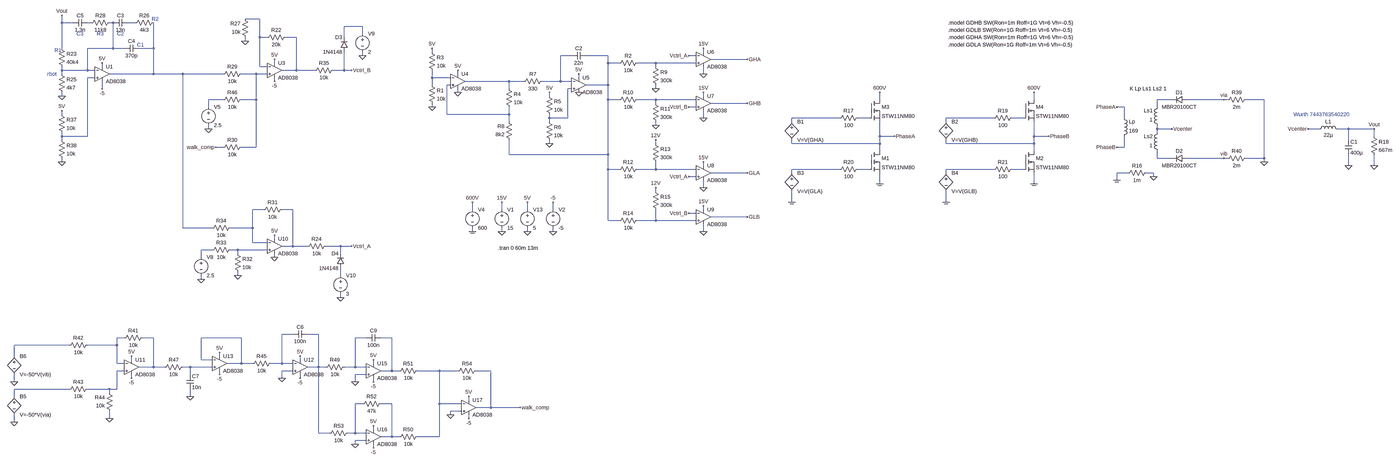
[diagram p0: schematic Full_Bridge_Converter.asc, whole sheet]
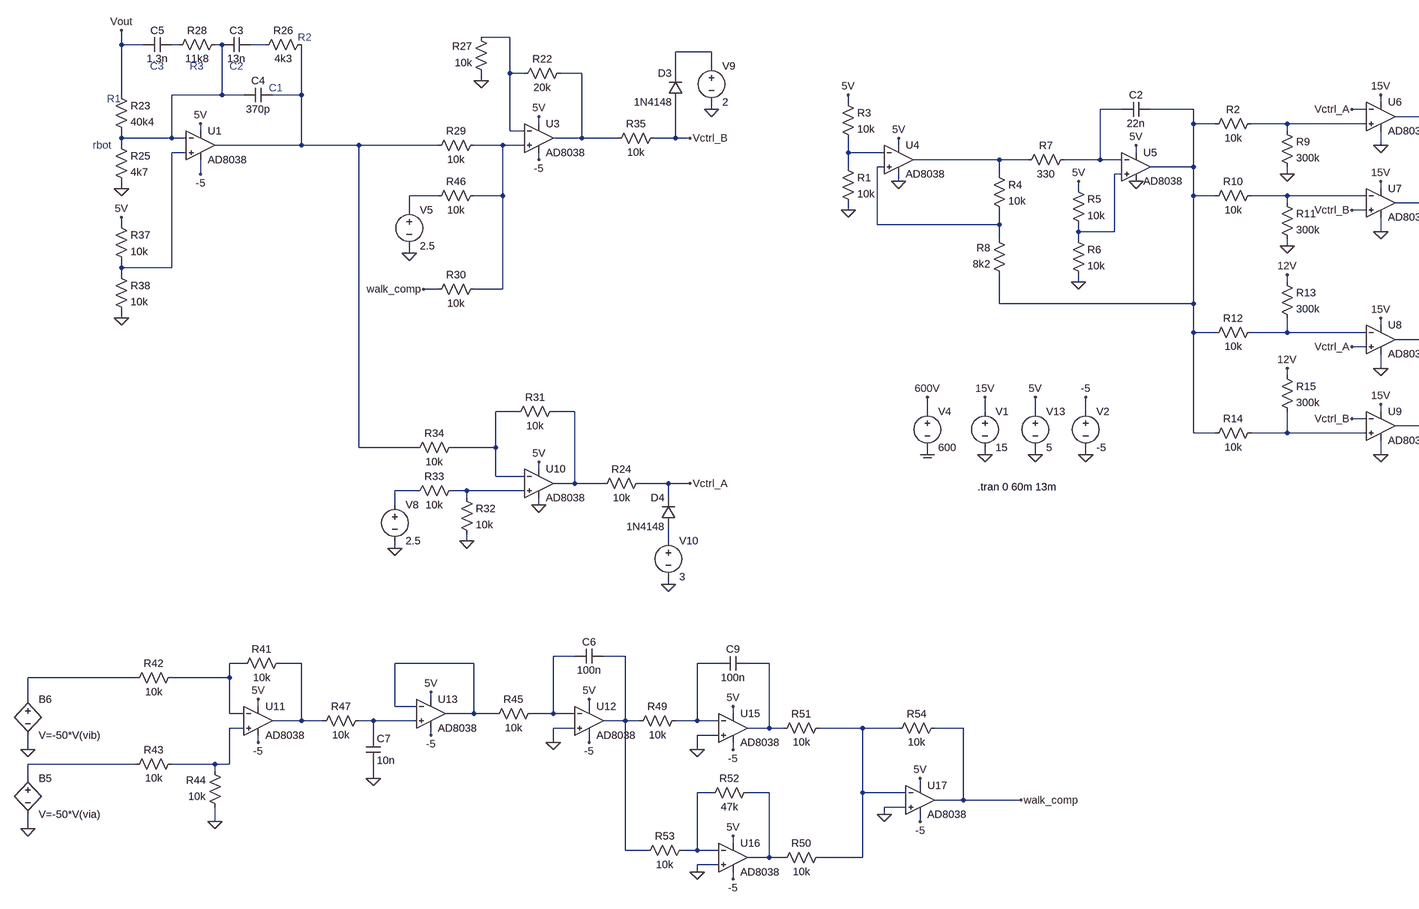
[diagram p1: schematic Full_Bridge_Converter.asc, part, row 1 of 1, column 1 of 2]
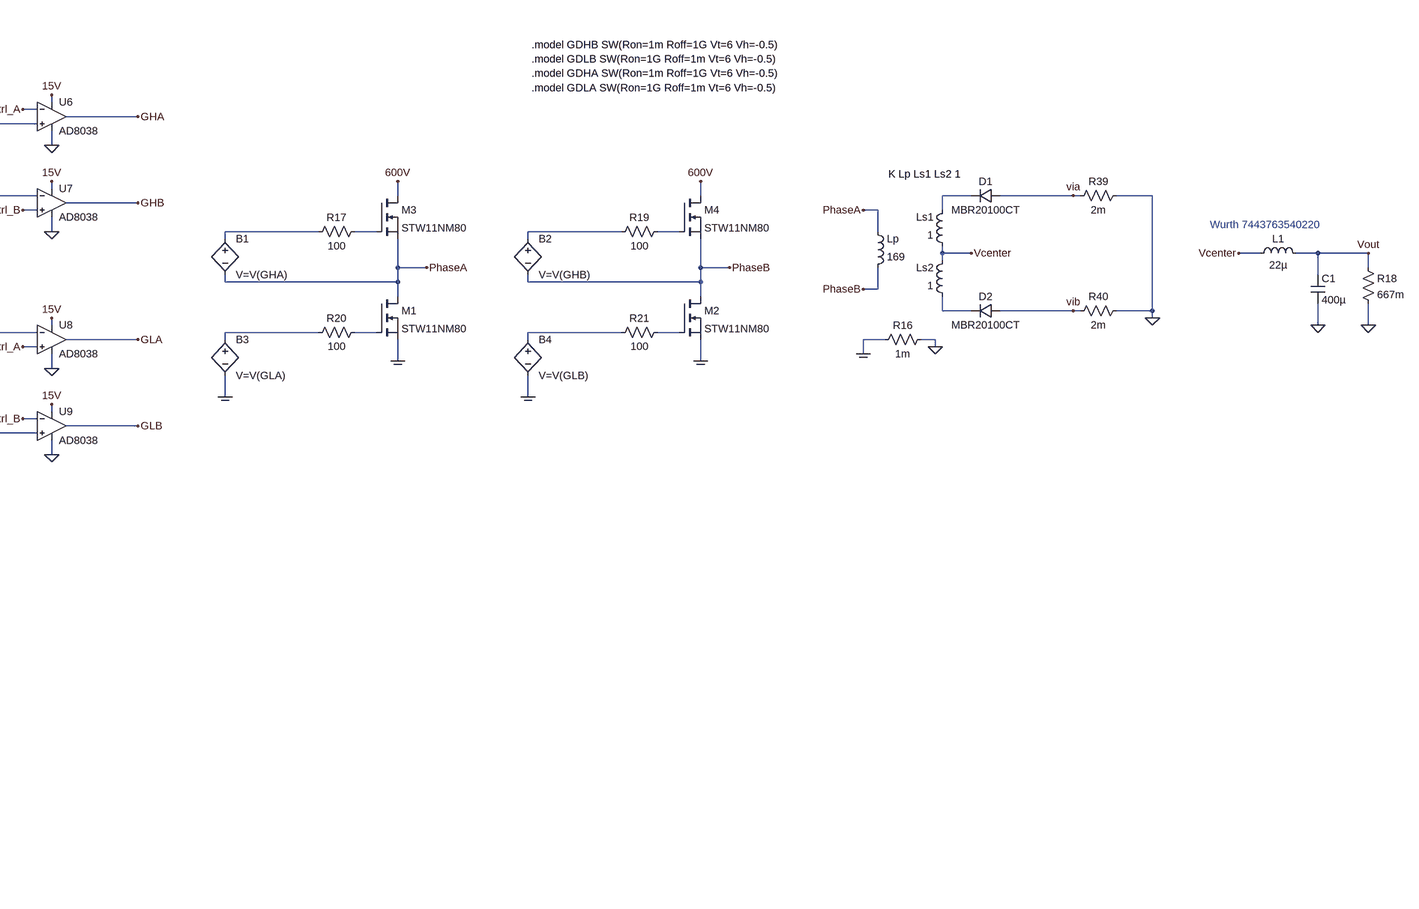
[diagram p2: schematic Full_Bridge_Converter.asc, part, row 1 of 1, column 2 of 2]
Full_Bridge_Converter.asc, the LTspice schematic file:
Version 4.1
SHEET 1 7284 1480
WIRE 320 -464 256 -464
WIRE -544 -448 -544 -480
WIRE -496 -448 -544 -448
WIRE -416 -448 -432 -448
WIRE -320 -448 -336 -448
WIRE -224 -448 -256 -448
WIRE 768 -432 688 -432
WIRE 768 -400 768 -432
WIRE 320 -384 320 -464
WIRE 352 -384 320 -384
WIRE 480 -384 432 -384
WIRE 688 -384 688 -432
WIRE 256 -368 256 -384
WIRE -544 -336 -544 -448
WIRE -320 -336 -320 -448
WIRE -320 -336 -432 -336
WIRE -272 -336 -320 -336
WIRE -144 -336 -144 -448
WIRE -144 -336 -208 -336
WIRE 1072 -320 1072 -336
WIRE 2256 -320 2256 -336
WIRE 768 -304 768 -320
WIRE 1680 -304 1632 -304
WIRE 1840 -304 1744 -304
WIRE 2224 -304 2192 -304
WIRE 2448 -288 2288 -288
WIRE 384 -272 384 -288
WIRE 1840 -272 1840 -304
WIRE 1888 -272 1840 -272
WIRE 2048 -272 1968 -272
WIRE 2224 -272 2048 -272
WIRE -368 -256 -368 -272
WIRE 320 -256 320 -384
WIRE 352 -256 320 -256
WIRE 2048 -256 2048 -272
WIRE -544 -240 -544 -256
WIRE -432 -240 -432 -336
WIRE -432 -240 -544 -240
WIRE -400 -240 -432 -240
WIRE 480 -240 480 -384
WIRE 480 -240 416 -240
WIRE 560 -240 480 -240
WIRE 688 -240 688 -320
WIRE 688 -240 640 -240
WIRE 720 -240 688 -240
WIRE -544 -224 -544 -240
WIRE -144 -224 -144 -336
WIRE -144 -224 -336 -224
WIRE -16 -224 -144 -224
WIRE 160 -224 -16 -224
WIRE 304 -224 240 -224
WIRE 352 -224 304 -224
WIRE 1184 -224 1184 -240
WIRE 2256 -224 2256 -256
WIRE -400 -208 -432 -208
WIRE 1072 -208 1072 -240
WIRE 1152 -208 1072 -208
WIRE 1712 -208 1712 -224
WIRE 384 -192 384 -208
WIRE 1408 -192 1216 -192
WIRE 1472 -192 1408 -192
WIRE 1632 -192 1632 -304
WIRE 1632 -192 1552 -192
WIRE 1680 -192 1632 -192
WIRE 1072 -176 1072 -208
WIRE 1152 -176 1136 -176
WIRE 1840 -176 1840 -272
WIRE 1840 -176 1744 -176
WIRE -368 -160 -368 -192
WIRE 1408 -160 1408 -192
WIRE 1680 -160 1664 -160
WIRE 2048 -160 2048 -176
WIRE 1184 -144 1184 -160
WIRE -544 -128 -544 -144
WIRE 1584 -128 1584 -144
WIRE 2256 -128 2256 -144
WIRE 160 -112 96 -112
WIRE 304 -112 304 -224
WIRE 304 -112 240 -112
WIRE 1840 -112 1840 -176
WIRE 1888 -112 1840 -112
WIRE 2048 -112 1968 -112
WIRE 2224 -112 2048 -112
WIRE 3184 -112 3184 -144
WIRE 3984 -112 3984 -144
WIRE 4704 -112 4640 -112
WIRE 4944 -112 4768 -112
WIRE 4960 -112 4944 -112
WIRE 5120 -112 5040 -112
WIRE 2048 -96 2048 -112
WIRE 2448 -96 2288 -96
WIRE 96 -80 96 -112
WIRE 1072 -80 1072 -96
WIRE 2224 -80 2192 -80
WIRE 4496 -80 4464 -80
WIRE 4640 -80 4640 -112
WIRE -544 -48 -544 -64
WIRE 1136 -48 1136 -176
WIRE 1408 -48 1408 -80
WIRE 1408 -48 1136 -48
WIRE 1584 -32 1584 -48
WIRE 1664 -32 1664 -160
WIRE 1664 -32 1584 -32
WIRE 2256 -32 2256 -64
WIRE 3008 -32 2800 -32
WIRE 3136 -32 3088 -32
WIRE 3808 -32 3600 -32
WIRE 3936 -32 3888 -32
WIRE 4496 -32 4496 -80
WIRE 1408 -16 1408 -48
WIRE 1584 -16 1584 -32
WIRE 2800 -16 2800 -32
WIRE 3600 -16 3600 -32
WIRE 2048 0 2048 -16
WIRE 96 16 96 0
WIRE 4640 16 4640 0
WIRE 4704 16 4640 16
WIRE 5360 16 5312 16
WIRE 5488 16 5440 16
WIRE 5600 16 5488 16
WIRE 4640 32 4640 16
WIRE -544 48 -544 32
WIRE -432 48 -432 -208
WIRE -432 48 -544 48
WIRE 3184 48 3184 -16
WIRE 3248 48 3184 48
WIRE 3984 48 3984 -16
WIRE 4048 48 3984 48
WIRE 5600 48 5600 16
WIRE -544 64 -544 48
WIRE 5488 64 5488 16
WIRE 1584 80 1584 64
WIRE 2048 80 2048 64
WIRE 2800 80 2800 64
WIRE 3184 80 3184 48
WIRE 3184 80 2800 80
WIRE 3600 80 3600 64
WIRE 3984 80 3984 48
WIRE 3984 80 3600 80
WIRE 160 96 128 96
WIRE 304 96 304 -112
WIRE 304 96 240 96
WIRE 4496 96 4496 48
WIRE 4496 96 4464 96
WIRE 3184 112 3184 80
WIRE 3984 112 3984 80
WIRE 1408 128 1408 64
WIRE 1840 128 1840 -112
WIRE 1840 128 1408 128
WIRE 4640 144 4640 112
WIRE 4704 144 4640 144
WIRE 4944 144 4768 144
WIRE 4960 144 4944 144
WIRE 5120 144 5120 -112
WIRE 5120 144 5040 144
WIRE -544 160 -544 144
WIRE 5120 160 5120 144
WIRE 2256 176 2256 160
WIRE 5488 176 5488 128
WIRE 5600 176 5600 128
WIRE 1840 192 1840 128
WIRE 1888 192 1840 192
WIRE 2048 192 2048 160
WIRE 2048 192 1968 192
WIRE 2224 192 2048 192
WIRE 3008 192 2800 192
WIRE 3136 192 3088 192
WIRE 3808 192 3600 192
WIRE 3936 192 3888 192
WIRE 2448 208 2288 208
WIRE 2800 208 2800 192
WIRE 3600 208 3600 192
WIRE 4512 208 4464 208
WIRE 4624 208 4592 208
WIRE 2224 224 2192 224
WIRE 4624 224 4624 208
WIRE 4464 240 4464 208
WIRE 3184 256 3184 208
WIRE 3984 256 3984 208
WIRE 2256 272 2256 240
WIRE 2048 288 2048 272
WIRE 2800 336 2800 288
WIRE 3600 336 3600 288
WIRE 336 368 288 368
WIRE 464 368 416 368
WIRE 1248 368 1248 336
WIRE 1376 368 1376 336
WIRE 1488 368 1488 336
WIRE 1600 368 1600 336
WIRE 2256 368 2256 352
WIRE 2224 384 2192 384
WIRE 2448 400 2288 400
WIRE 1840 416 1840 192
WIRE 1888 416 1840 416
WIRE 2048 416 2048 368
WIRE 2048 416 1968 416
WIRE 2224 416 2048 416
WIRE -16 448 -16 -224
WIRE 112 448 -16 448
WIRE 288 448 288 368
WIRE 288 448 192 448
WIRE 1248 464 1248 448
WIRE 1376 464 1376 448
WIRE 1488 464 1488 448
WIRE 1600 464 1600 448
WIRE 2256 464 2256 432
WIRE 384 496 384 480
WIRE 288 512 288 448
WIRE 352 512 288 512
WIRE 464 528 464 368
WIRE 464 528 416 528
WIRE 528 528 464 528
WIRE 672 528 608 528
WIRE 720 528 672 528
WIRE 112 544 64 544
WIRE 224 544 192 544
WIRE 352 544 224 544
WIRE 224 560 224 544
WIRE 672 560 672 528
WIRE 64 576 64 544
WIRE 384 576 384 560
WIRE 224 656 224 640
WIRE 672 656 672 624
WIRE 64 672 64 656
WIRE 672 752 672 736
WIRE 464 912 416 912
WIRE 576 912 528 912
WIRE -272 928 -304 928
WIRE -144 928 -192 928
WIRE 240 928 64 928
WIRE 784 928 736 928
WIRE 896 928 848 928
WIRE -512 960 -752 960
WIRE -304 960 -304 928
WIRE -304 960 -432 960
WIRE -752 1008 -752 960
WIRE 144 1008 144 992
WIRE -240 1024 -240 1008
WIRE 64 1024 64 928
WIRE 112 1024 64 1024
WIRE 496 1024 496 1008
WIRE -304 1040 -304 960
WIRE -272 1040 -304 1040
WIRE 240 1040 240 928
WIRE 240 1040 176 1040
WIRE 288 1040 240 1040
WIRE 416 1040 416 912
WIRE 416 1040 368 1040
WIRE 464 1040 416 1040
WIRE 816 1040 816 1024
WIRE -144 1056 -144 928
WIRE -144 1056 -208 1056
WIRE -96 1056 -144 1056
WIRE 16 1056 -16 1056
WIRE 112 1056 16 1056
WIRE 576 1056 576 912
WIRE 576 1056 528 1056
WIRE 608 1056 576 1056
WIRE 736 1056 736 928
WIRE 736 1056 688 1056
WIRE 784 1056 736 1056
WIRE -272 1072 -304 1072
WIRE 464 1072 416 1072
WIRE 896 1072 896 928
WIRE 896 1072 848 1072
WIRE 928 1072 896 1072
WIRE 1104 1072 1008 1072
WIRE 1184 1072 1104 1072
WIRE 1328 1072 1264 1072
WIRE 16 1088 16 1056
WIRE 144 1088 144 1072
WIRE 784 1088 736 1088
WIRE -240 1104 -240 1088
WIRE 416 1104 416 1072
WIRE 496 1104 496 1088
WIRE -752 1120 -752 1088
WIRE 736 1120 736 1088
WIRE 816 1120 816 1104
WIRE -512 1152 -752 1152
WIRE -336 1152 -432 1152
WIRE -304 1152 -304 1072
WIRE -304 1152 -336 1152
WIRE -336 1168 -336 1152
WIRE -752 1184 -752 1152
WIRE 16 1184 16 1152
WIRE 1232 1200 1232 1184
WIRE 768 1216 736 1216
WIRE 896 1216 848 1216
WIRE 1104 1216 1104 1072
WIRE 1200 1216 1104 1216
WIRE 1328 1232 1328 1072
WIRE 1328 1232 1264 1232
WIRE 1456 1232 1328 1232
WIRE 1200 1248 1152 1248
WIRE 1152 1264 1152 1248
WIRE -336 1280 -336 1248
WIRE 1232 1280 1232 1264
WIRE -752 1296 -752 1264
WIRE 816 1328 816 1312
WIRE 576 1344 576 1056
WIRE 624 1344 576 1344
WIRE 736 1344 736 1216
WIRE 736 1344 704 1344
WIRE 784 1344 736 1344
WIRE 896 1360 896 1216
WIRE 896 1360 848 1360
WIRE 928 1360 896 1360
WIRE 1104 1360 1104 1216
WIRE 1104 1360 1008 1360
WIRE 784 1376 736 1376
WIRE 736 1392 736 1376
WIRE 816 1408 816 1392
FLAG 1376 464 0
FLAG 1376 336 15V
FLAG 1184 -144 0
FLAG 1072 -80 0
FLAG 1584 80 0
FLAG 1712 -144 0
FLAG 2256 -224 0
FLAG 2256 -32 0
FLAG 2192 -304 Vctrl_A
FLAG 2192 -80 Vctrl_B
FLAG 2448 -288 GHA
FLAG 2448 -96 GHB
FLAG 2256 272 0
FLAG 2256 464 0
FLAG 2192 224 Vctrl_A
FLAG 2192 384 Vctrl_B
FLAG 2448 208 GLA
FLAG 2448 400 GLB
FLAG 2048 -160 0
FLAG 2048 0 0
FLAG 2048 64 12V
FLAG 2048 272 12V
FLAG 1248 336 600V
FLAG 3184 -144 600V
FLAG 3984 -144 600V
FLAG 4048 48 PhaseB
FLAG 3248 48 PhaseA
FLAG 4464 96 PhaseB
FLAG 4464 -80 PhaseA
FLAG -544 -128 0
FLAG 5600 16 Vout
FLAG -544 -480 Vout
FLAG 4624 224 0
FLAG 5488 176 0
FLAG 5600 176 0
FLAG 4464 240 COM
FLAG 3984 256 COM
FLAG 3600 336 COM
FLAG 3184 256 COM
FLAG 2800 336 COM
FLAG 1248 464 COM
FLAG 256 -368 0
FLAG 96 16 0
FLAG 384 576 0
FLAG 224 656 0
FLAG 64 672 0
FLAG 720 -240 Vctrl_B
FLAG 720 528 Vctrl_A
FLAG 672 752 0
FLAG 768 -304 0
FLAG 1488 464 0
FLAG 1488 336 5V
FLAG 1072 -336 5V
FLAG 1184 -240 5V
FLAG 1584 -144 5V
FLAG 1712 -224 5V
FLAG 1600 464 0
FLAG 1600 336 -5
FLAG -368 -160 -5
FLAG -368 -272 5V
FLAG -544 160 0
FLAG -544 -64 5V
FLAG 384 -288 5V
FLAG 384 480 5V
FLAG 2256 -336 15V
FLAG 2256 -144 15V
FLAG 2256 160 15V
FLAG 2256 352 15V
FLAG 5120 160 0
FLAG 5312 16 Vcenter
FLAG 4704 16 Vcenter
FLAG -752 1296 0
FLAG -752 1120 0
FLAG 4944 -112 via
FLAG 4944 144 vib
FLAG -240 1008 5V
FLAG -240 1104 -5
FLAG -336 1280 0
FLAG 128 96 walk_comp
FLAG 384 -192 -5
FLAG 496 1008 5V
FLAG 496 1104 -5
FLAG 416 1104 0
FLAG 16 1184 0
FLAG 144 992 5V
FLAG 144 1088 -5
FLAG 816 1024 5V
FLAG 816 1120 -5
FLAG 736 1120 0
FLAG 1456 1232 walk_comp
FLAG 816 1312 5V
FLAG 816 1408 -5
FLAG 1232 1184 5V
FLAG 1232 1280 -5
FLAG 1152 1264 0
FLAG 736 1392 0
SYMBOL voltage 1376 352 R0
WINDOW 123 0 0 Left 0
WINDOW 39 0 0 Left 0
SYMATTR InstName V1
SYMATTR Value 15
SYMBOL res 1056 -192 R0
SYMATTR InstName R1
SYMATTR Value 10k
SYMBOL res 1056 -336 R0
SYMATTR InstName R3
SYMATTR Value 10k
SYMBOL res 1392 -176 R0
SYMATTR InstName R4
SYMATTR Value 10k
SYMBOL OpAmps\\AD8038 1184 -256 R0
SYMATTR InstName U4
SYMBOL OpAmps\\AD8038 1712 -240 R0
SYMATTR InstName U5
SYMBOL res 1568 -144 R0
SYMATTR InstName R5
SYMATTR Value 10k
SYMBOL res 1568 -32 R0
SYMATTR InstName R6
SYMATTR Value 10k
SYMBOL res 1568 -208 R90
WINDOW 0 0 56 VBottom 2
WINDOW 3 32 56 VTop 2
SYMATTR InstName R7
SYMATTR Value 330
SYMBOL res 1424 80 R180
WINDOW 0 36 76 Left 2
WINDOW 3 36 40 Left 2
SYMATTR InstName R8
SYMATTR Value 8k2
SYMBOL cap 1744 -320 R90
WINDOW 0 0 32 VBottom 2
WINDOW 3 32 32 VTop 2
SYMATTR InstName C2
SYMATTR Value 22n
SYMBOL OpAmps\\AD8038 2256 -352 R0
SYMATTR InstName U6
SYMBOL OpAmps\\AD8038 2256 -160 R0
SYMATTR InstName U7
SYMBOL OpAmps\\AD8038 2256 144 R0
SYMATTR InstName U8
SYMBOL OpAmps\\AD8038 2256 336 R0
SYMATTR InstName U9
SYMBOL res 1984 -288 R90
WINDOW 0 0 56 VBottom 2
WINDOW 3 32 56 VTop 2
SYMATTR InstName R2
SYMATTR Value 10k
SYMBOL res 2032 -272 R0
SYMATTR InstName R9
SYMATTR Value 300k
SYMBOL res 1984 -128 R90
WINDOW 0 0 56 VBottom 2
WINDOW 3 32 56 VTop 2
SYMATTR InstName R10
SYMATTR Value 10k
SYMBOL res 2032 -112 R0
SYMATTR InstName R11
SYMATTR Value 300k
SYMBOL res 1984 176 R90
WINDOW 0 0 56 VBottom 2
WINDOW 3 32 56 VTop 2
SYMATTR InstName R12
SYMATTR Value 10k
SYMBOL res 1984 400 R90
WINDOW 0 0 56 VBottom 2
WINDOW 3 32 56 VTop 2
SYMATTR InstName R14
SYMATTR Value 10k
SYMBOL res 2032 64 R0
SYMATTR InstName R13
SYMATTR Value 300k
SYMBOL res 2032 272 R0
SYMATTR InstName R15
SYMATTR Value 300k
SYMBOL nmos 3136 112 R0
SYMATTR InstName M1
SYMATTR Value STW11NM80
SYMBOL voltage 1248 352 R0
WINDOW 123 0 0 Left 0
WINDOW 39 0 0 Left 0
SYMATTR InstName V4
SYMATTR Value 600
SYMBOL res 3104 -48 R90
WINDOW 0 0 56 VBottom 2
WINDOW 3 32 56 VTop 2
SYMATTR InstName R17
SYMATTR Value 100
SYMBOL res 3904 -48 R90
WINDOW 0 0 56 VBottom 2
WINDOW 3 32 56 VTop 2
SYMATTR InstName R19
SYMATTR Value 100
SYMBOL nmos 3936 112 R0
SYMATTR InstName M2
SYMATTR Value STW11NM80
SYMBOL nmos 3136 -112 R0
SYMATTR InstName M3
SYMATTR Value STW11NM80
SYMBOL nmos 3936 -112 R0
SYMATTR InstName M4
SYMATTR Value STW11NM80
SYMBOL bv 2800 -32 R0
SYMATTR InstName B1
SYMATTR Value V=V(GHA)
SYMBOL bv 3600 -32 R0
SYMATTR InstName B2
SYMATTR Value V=V(GHB)
SYMBOL ind 4480 64 M180
WINDOW 0 36 80 Left 2
WINDOW 3 36 40 Left 2
SYMATTR InstName Lp
SYMATTR Value 169
SYMATTR SpiceLine Rser=10m
SYMBOL ind 4656 16 R180
WINDOW 0 36 80 Left 2
WINDOW 3 36 40 Left 2
SYMATTR InstName Ls1
SYMATTR Value 1
SYMATTR SpiceLine Rser=10m
SYMBOL ind 4656 128 R180
WINDOW 0 36 80 Left 2
WINDOW 3 36 40 Left 2
SYMATTR InstName Ls2
SYMATTR Value 1
SYMATTR SpiceLine Rser=10m
SYMBOL res 4608 192 R90
WINDOW 0 0 56 VBottom 2
WINDOW 3 32 56 VTop 2
SYMATTR InstName R16
SYMATTR Value 1m
SYMBOL bv 2800 192 R0
SYMATTR InstName B3
SYMATTR Value V=V(GLA)
SYMBOL bv 3600 192 R0
SYMATTR InstName B4
SYMATTR Value V=V(GLB)
SYMBOL ind 5344 32 R270
WINDOW 0 32 56 VTop 2
WINDOW 3 5 56 VBottom 2
SYMATTR InstName L1
SYMATTR Value 22µ
SYMBOL cap 5472 64 R0
SYMATTR InstName C1
SYMATTR Value 400µ
SYMBOL res 5584 32 R0
SYMATTR InstName R18
SYMATTR Value 667m
SYMBOL diode 4768 -96 M270
WINDOW 0 32 32 VTop 2
WINDOW 3 0 32 VBottom 2
SYMATTR InstName D1
SYMATTR Value MBR20100CT
SYMBOL diode 4768 160 M270
WINDOW 0 32 32 VTop 2
WINDOW 3 0 32 VBottom 2
SYMATTR InstName D2
SYMATTR Value MBR20100CT
SYMBOL res 3104 176 R90
WINDOW 0 0 56 VBottom 2
WINDOW 3 32 56 VTop 2
SYMATTR InstName R20
SYMATTR Value 100
SYMBOL res 3904 176 R90
WINDOW 0 0 56 VBottom 2
WINDOW 3 32 56 VTop 2
SYMATTR InstName R21
SYMATTR Value 100
SYMBOL res -560 -352 R0
SYMATTR InstName R23
SYMATTR Value 40k4
SYMBOL res -560 -240 R0
SYMATTR InstName R25
SYMATTR Value 4k7
SYMBOL cap -256 -464 R90
WINDOW 0 0 32 VBottom 2
WINDOW 3 32 32 VTop 2
SYMATTR InstName C3
SYMATTR Value 13n
SYMBOL cap -208 -352 R90
WINDOW 0 0 32 VBottom 2
WINDOW 3 32 32 VTop 2
SYMATTR InstName C4
SYMATTR Value 370p
SYMBOL res -128 -464 R90
WINDOW 0 0 56 VBottom 2
WINDOW 3 32 56 VTop 2
SYMATTR InstName R26
SYMATTR Value 4k3
SYMBOL OpAmps\\AD8038 -368 -288 R0
SYMATTR InstName U1
SYMBOL OpAmps\\AD8038 384 -304 R0
SYMATTR InstName U3
SYMBOL res 448 -400 R90
WINDOW 0 0 56 VBottom 2
WINDOW 3 32 56 VTop 2
SYMATTR InstName R22
SYMATTR Value 20k
SYMBOL res 272 -368 R180
WINDOW 0 36 76 Left 2
WINDOW 3 36 40 Left 2
SYMATTR InstName R27
SYMATTR Value 10k
SYMBOL res 256 -240 R90
WINDOW 0 0 56 VBottom 2
WINDOW 3 32 56 VTop 2
SYMATTR InstName R29
SYMATTR Value 10k
SYMBOL res 256 80 R90
WINDOW 0 0 56 VBottom 2
WINDOW 3 32 56 VTop 2
SYMATTR InstName R30
SYMATTR Value 10k
SYMBOL voltage 96 -96 R0
WINDOW 123 0 0 Left 0
WINDOW 39 0 0 Left 0
SYMATTR InstName V5
SYMATTR Value 2.5
SYMBOL OpAmps\\AD8038 384 464 R0
SYMATTR InstName U10
SYMBOL res 432 352 R90
WINDOW 0 0 56 VBottom 2
WINDOW 3 32 56 VTop 2
SYMATTR InstName R31
SYMATTR Value 10k
SYMBOL res 208 544 R0
SYMATTR InstName R32
SYMATTR Value 10k
SYMBOL res 208 528 R90
WINDOW 0 0 56 VBottom 2
WINDOW 3 32 56 VTop 2
SYMATTR InstName R33
SYMATTR Value 10k
SYMBOL res 208 432 R90
WINDOW 0 0 56 VBottom 2
WINDOW 3 32 56 VTop 2
SYMATTR InstName R34
SYMATTR Value 10k
SYMBOL voltage 64 560 R0
WINDOW 123 0 0 Left 0
WINDOW 39 0 0 Left 0
SYMATTR InstName V8
SYMATTR Value 2.5
SYMBOL diode 688 624 R180
WINDOW 0 24 64 Left 2
WINDOW 3 24 0 Left 2
SYMATTR InstName D4
SYMATTR Value 1N4148
SYMBOL voltage 672 640 R0
WINDOW 123 0 0 Left 0
WINDOW 39 0 0 Left 0
SYMATTR InstName V10
SYMATTR Value 3
SYMBOL res 624 512 R90
WINDOW 0 0 56 VBottom 2
WINDOW 3 32 56 VTop 2
SYMATTR InstName R24
SYMATTR Value 10k
SYMBOL res 656 -256 R90
WINDOW 0 0 56 VBottom 2
WINDOW 3 32 56 VTop 2
SYMATTR InstName R35
SYMATTR Value 10k
SYMBOL diode 704 -320 R180
WINDOW 0 24 64 Left 2
WINDOW 3 24 0 Left 2
SYMATTR InstName D3
SYMATTR Value 1N4148
SYMBOL voltage 768 -416 R0
WINDOW 123 0 0 Left 0
WINDOW 39 0 0 Left 0
SYMATTR InstName V9
SYMATTR Value 2
SYMBOL res -320 -464 R90
WINDOW 0 0 56 VBottom 2
WINDOW 3 32 56 VTop 2
SYMATTR InstName R28
SYMATTR Value 11k8
SYMBOL cap -432 -464 R90
WINDOW 0 0 32 VBottom 2
WINDOW 3 32 32 VTop 2
SYMATTR InstName C5
SYMATTR Value 1.3n
SYMBOL voltage 1488 352 R0
WINDOW 123 0 0 Left 0
WINDOW 39 0 0 Left 0
SYMATTR InstName V13
SYMATTR Value 5
SYMBOL voltage 1600 352 R0
WINDOW 123 0 0 Left 0
WINDOW 39 0 0 Left 0
SYMATTR InstName V2
SYMATTR Value -5
SYMBOL res -560 -64 R0
SYMATTR InstName R37
SYMATTR Value 10k
SYMBOL res -560 48 R0
SYMATTR InstName R38
SYMATTR Value 10k
SYMBOL res 5056 -128 R90
WINDOW 0 0 56 VBottom 2
WINDOW 3 32 56 VTop 2
SYMATTR InstName R39
SYMATTR Value 2m
SYMBOL res 5056 128 R90
WINDOW 0 0 56 VBottom 2
WINDOW 3 32 56 VTop 2
SYMATTR InstName R40
SYMATTR Value 2m
SYMBOL bv -752 1168 R0
SYMATTR InstName B5
SYMATTR Value V=-50*V(via)
SYMBOL bv -752 992 R0
SYMATTR InstName B6
SYMATTR Value V=-50*V(vib)
SYMBOL OpAmps\\AD8038 -240 992 R0
SYMATTR InstName U11
SYMBOL res -176 912 R90
WINDOW 0 0 56 VBottom 2
WINDOW 3 32 56 VTop 2
SYMATTR InstName R41
SYMATTR Value 10k
SYMBOL res -416 944 R90
WINDOW 0 0 56 VBottom 2
WINDOW 3 32 56 VTop 2
SYMATTR InstName R42
SYMATTR Value 10k
SYMBOL res -416 1136 R90
WINDOW 0 0 56 VBottom 2
WINDOW 3 32 56 VTop 2
SYMATTR InstName R43
SYMATTR Value 10k
SYMBOL res -320 1264 R180
WINDOW 0 36 76 Left 2
WINDOW 3 36 40 Left 2
SYMATTR InstName R44
SYMATTR Value 10k
SYMBOL res 256 -128 R90
WINDOW 0 0 56 VBottom 2
WINDOW 3 32 56 VTop 2
SYMATTR InstName R46
SYMATTR Value 10k
SYMBOL OpAmps\\AD8038 496 992 R0
SYMATTR InstName U12
SYMBOL cap 528 896 R90
WINDOW 0 0 32 VBottom 2
WINDOW 3 32 32 VTop 2
SYMATTR InstName C6
SYMATTR Value 100n
SYMBOL res 384 1024 R90
WINDOW 0 0 56 VBottom 2
WINDOW 3 32 56 VTop 2
SYMATTR InstName R45
SYMATTR Value 10k
SYMBOL res 0 1040 R90
WINDOW 0 0 56 VBottom 2
WINDOW 3 32 56 VTop 2
SYMATTR InstName R47
SYMATTR Value 10k
SYMBOL cap 0 1088 R0
SYMATTR InstName C7
SYMATTR Value 10n
SYMBOL OpAmps\\AD8038 144 976 R0
SYMATTR InstName U13
SYMBOL OpAmps\\AD8038 816 1008 R0
SYMATTR InstName U15
SYMBOL cap 848 912 R90
WINDOW 0 0 32 VBottom 2
WINDOW 3 32 32 VTop 2
SYMATTR InstName C9
SYMATTR Value 100n
SYMBOL res 704 1040 R90
WINDOW 0 0 56 VBottom 2
WINDOW 3 32 56 VTop 2
SYMATTR InstName R49
SYMATTR Value 10k
SYMBOL OpAmps\\AD8038 816 1296 R0
SYMATTR InstName U16
SYMBOL res 1024 1344 R90
WINDOW 0 0 56 VBottom 2
WINDOW 3 32 56 VTop 2
SYMATTR InstName R50
SYMATTR Value 10k
SYMBOL res 1024 1056 R90
WINDOW 0 0 56 VBottom 2
WINDOW 3 32 56 VTop 2
SYMATTR InstName R51
SYMATTR Value 10k
SYMBOL res 864 1200 R90
WINDOW 0 0 56 VBottom 2
WINDOW 3 32 56 VTop 2
SYMATTR InstName R52
SYMATTR Value 47k
SYMBOL res 720 1328 R90
WINDOW 0 0 56 VBottom 2
WINDOW 3 32 56 VTop 2
SYMATTR InstName R53
SYMATTR Value 10k
SYMBOL OpAmps\\AD8038 1232 1168 R0
SYMATTR InstName U17
SYMBOL res 1280 1056 R90
WINDOW 0 0 56 VBottom 2
WINDOW 3 32 56 VTop 2
SYMATTR InstName R54
SYMATTR Value 10k
TEXT 1360 536 Left 2 !.tran 0 60m 13m
TEXT 3608 -384 Left 2 !.model GDHA SW(Ron=1m Roff=1G Vt=6 Vh=-0.5)
TEXT 3608 -352 Left 2 !.model GDLA SW(Ron=1G Roff=1m Vt=6 Vh=-0.5)
TEXT 3608 -448 Left 2 !.model GDHB SW(Ron=1m Roff=1G Vt=6 Vh=-0.5)
TEXT 3608 -416 Left 2 !.model GDLB SW(Ron=1G Roff=1m Vt=6 Vh=-0.5)
TEXT 4520 -160 Left 2 !K Lp Ls1 Ls2 1
TEXT -216 -352 Left 2 ;C1
TEXT -304 -400 Left 2 ;C2
TEXT -392 -400 Left 2 ;R3
TEXT -480 -400 Left 2 ;C3
TEXT -152 -464 Left 2 ;R2
TEXT -576 -328 Left 2 ;R1
TEXT -608 -224 Left 2 ;rbot
TEXT 5248 -48 Left 2 ;Wurth 7443763540220

The netlist it stands for:
* Full_Bridge_Converter.asc
V1 15V 0 15
R1 N013 0 10k
R3 5V N013 10k
R4 N014 N015 10k
X§U4 N015 N013 5V 0 N014 AD8038  ; pins In+ In- V+ V- OUT
X§U5 N016 N008 5V 0 N009 AD8038  ; pins In+ In- V+ V- OUT
R5 5V N016 10k
R6 N016 0 10k
R7 N008 N014 330
R8 N009 N015 8k2
C2 N009 N008 22n
X§U6 N010 Vctrl_A 15V 0 GHA AD8038  ; pins In+ In- V+ V- OUT
X§U7 Vctrl_B N018 15V 0 GHB AD8038  ; pins In+ In- V+ V- OUT
X§U8 Vctrl_A N025 15V 0 GLA AD8038  ; pins In+ In- V+ V- OUT
X§U9 N032 Vctrl_B 15V 0 GLB AD8038  ; pins In+ In- V+ V- OUT
R2 N010 N009 10k
R9 N010 0 300k
R10 N018 N009 10k
R11 N018 0 300k
R12 N025 N009 10k
R14 N032 N009 10k
R13 12V N025 300k
R15 12V N032 300k
M1 PhaseA N027 COM COM STW11NM80
V4 600V COM 600
R17 N021 N020 100
R19 N023 N022 100
M2 PhaseB N029 COM COM STW11NM80
M3 600V N021 PhaseA PhaseA STW11NM80
M4 600V N023 PhaseB PhaseB STW11NM80
B1 N020 PhaseA V=V(GHA)
B2 N022 PhaseB V=V(GHB)
Lp PhaseB PhaseA 169 Rser=10m
Ls1 Vcenter N019 1 Rser=10m
Ls2 N024 Vcenter 1 Rser=10m
R16 0 COM 1m
B3 N026 COM V=V(GLA)
B4 N028 COM V=V(GLB)
L1 Vcenter Vout 22µ
C1 Vout 0 400µ
R18 Vout 0 667m
D1 via N019 MBR20100CT
D2 vib N024 MBR20100CT
R20 N027 N026 100
R21 N029 N028 100
R23 Vout N003 40k4
R25 N003 0 4k7
C3 N004 N003 13n
C4 N007 N003 370p
R26 N007 N004 4k3
X§U1 N012 N003 5V -5 N007 AD8038  ; pins In+ In- V+ V- OUT
X§U3 N011 N001 5V -5 N006 AD8038  ; pins In+ In- V+ V- OUT
R22 N006 N001 20k
R27 0 N001 10k
R29 N011 N007 10k
R30 N011 walk_comp 10k
V5 N017 0 2.5
X§U10 N034 N030 5V 0 N031 AD8038  ; pins In+ In- V+ V- OUT
R31 N031 N030 10k
R32 N034 0 10k
R33 N034 N033 10k
R34 N030 N007 10k
V8 N033 0 2.5
D4 N035 Vctrl_A 1N4148
V10 N035 0 3
R24 Vctrl_A N031 10k
R35 Vctrl_B N006 10k
D3 Vctrl_B N005 1N4148
V9 N005 0 2
R28 N003 N002 11k8
C5 N002 Vout 1.3n
V13 5V 0 5
V2 -5 0 -5
R37 5V N012 10k
R38 N012 0 10k
R39 0 via 2m
R40 0 vib 2m
B5 N047 0 V=-50*V(via)
B6 N043 0 V=-50*V(vib)
X§U11 N045 N038 5V -5 N039 AD8038  ; pins In+ In- V+ V- OUT
R41 N039 N038 10k
R42 N038 N043 10k
R43 N045 N047 10k
R44 0 N045 10k
R46 N011 N017 10k
X§U12 0 N036 5V -5 N037 AD8038  ; pins In+ In- V+ V- OUT
C6 N037 N036 100n
R45 N036 N040 10k
R47 N044 N039 10k
C7 N044 0 10n
X§U13 N044 N040 5V -5 N040 AD8038  ; pins In+ In- V+ V- OUT
X§U15 0 N041 5V -5 N042 AD8038  ; pins In+ In- V+ V- OUT
C9 N042 N041 100n
R49 N041 N037 10k
X§U16 0 N048 5V -5 N049 AD8038  ; pins In+ In- V+ V- OUT
R50 N046 N049 10k
R51 N046 N042 10k
R52 N049 N048 47k
R53 N048 N037 10k
X§U17 0 N046 5V -5 walk_comp AD8038  ; pins In+ In- V+ V- OUT
R54 walk_comp N046 10k
.model D D
.lib standard.dio
.model NMOS NMOS
.model PMOS PMOS
.lib standard.mos
.tran 0 60m 13m
.model GDHA SW(Ron=1m Roff=1G Vt=6 Vh=-0.5)
.model GDLA SW(Ron=1G Roff=1m Vt=6 Vh=-0.5)
.model GDHB SW(Ron=1m Roff=1G Vt=6 Vh=-0.5)
.model GDLB SW(Ron=1G Roff=1m Vt=6 Vh=-0.5)
K Lp Ls1 Ls2 1
* C1
* C2
* R3
* C3
* R2
* R1
* rbot
* Wurth 7443763540220
.backanno
.end